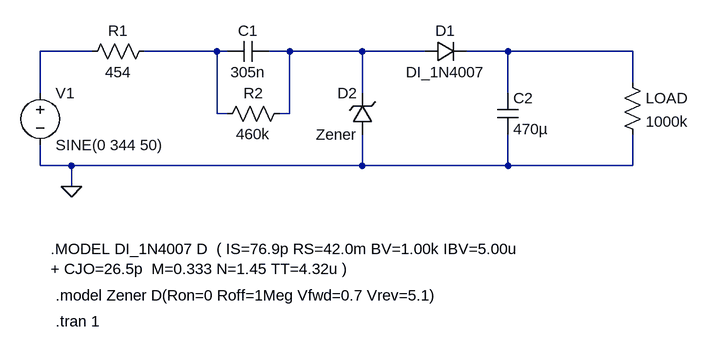
[diagram p0: schematic WithoutTransformer2.asc]
WithoutTransformer2.asc, the LTspice schematic file:
Version 4
SHEET 1 1024 680
WIRE 96 80 16 80
WIRE 288 80 176 80
WIRE 304 80 288 80
WIRE 400 80 368 80
WIRE 512 80 400 80
WIRE 608 80 512 80
WIRE 736 80 672 80
WIRE 928 80 736 80
WIRE 928 128 928 80
WIRE 16 144 16 80
WIRE 512 144 512 80
WIRE 736 144 736 80
WIRE 288 176 288 80
WIRE 304 176 288 176
WIRE 400 176 400 80
WIRE 400 176 384 176
WIRE 16 256 16 224
WIRE 64 256 16 256
WIRE 512 256 512 208
WIRE 512 256 64 256
WIRE 736 256 736 208
WIRE 736 256 512 256
WIRE 928 256 928 208
WIRE 928 256 736 256
WIRE 64 288 64 256
FLAG 64 288 0
SYMBOL voltage 16 128 R0
WINDOW 123 0 0 Left 0
WINDOW 39 0 0 Left 0
SYMATTR InstName V1
SYMATTR Value SINE(0 344 50)
SYMBOL res 192 64 R90
WINDOW 0 0 56 VBottom 2
WINDOW 3 32 56 VTop 2
SYMATTR InstName R1
SYMATTR Value 454
SYMBOL res 400 160 R90
WINDOW 0 0 56 VBottom 2
WINDOW 3 32 56 VTop 2
SYMATTR InstName R2
SYMATTR Value 460k
SYMBOL cap 368 64 R90
WINDOW 0 0 32 VBottom 2
WINDOW 3 32 32 VTop 2
SYMATTR InstName C1
SYMATTR Value 305n
SYMBOL cap 720 144 R0
SYMATTR InstName C2
SYMATTR Value 470µ
SYMBOL diode 608 96 R270
WINDOW 0 32 32 VTop 2
WINDOW 3 0 32 VBottom 2
SYMATTR InstName D1
SYMATTR Value DI_1N4007
SYMBOL zener 528 208 R180
WINDOW 0 24 64 Left 2
WINDOW 3 24 0 Left 2
SYMATTR InstName D2
SYMATTR Value Zener
SYMBOL res 912 112 R0
SYMATTR InstName LOAD
SYMATTR Value 1000k
TEXT 32 384 Left 2 !.MODEL DI_1N4007 D  ( IS=76.9p RS=42.0m BV=1.00k IBV=5.00u\n+ CJO=26.5p  M=0.333 N=1.45 TT=4.32u )
TEXT 40 456 Left 2 !.model Zener D(Ron=0 Roff=1Meg Vfwd=0.7 Vrev=5.1)
TEXT 40 496 Left 2 !.tran 1

The netlist it stands for:
* WithoutTransformer2.asc
V1 N001 0 SINE(0 344 50)
R1 N002 N001 454
R2 N003 N002 460k
C1 N003 N002 305n
C2 N004 0 470µ
D1 N003 N004 DI_1N4007
D2 0 N003 Zener
R§LOAD N004 0 1000k
.model D D
.lib standard.dio
.MODEL DI_1N4007 D  ( IS=76.9p RS=42.0m BV=1.00k IBV=5.00u
+ CJO=26.5p  M=0.333 N=1.45 TT=4.32u )
.model Zener D(Ron=0 Roff=1Meg Vfwd=0.7 Vrev=5.1)
.tran 1
.backanno
.end